# Altium schematic sheet Sheet1.SchDoc
size A3
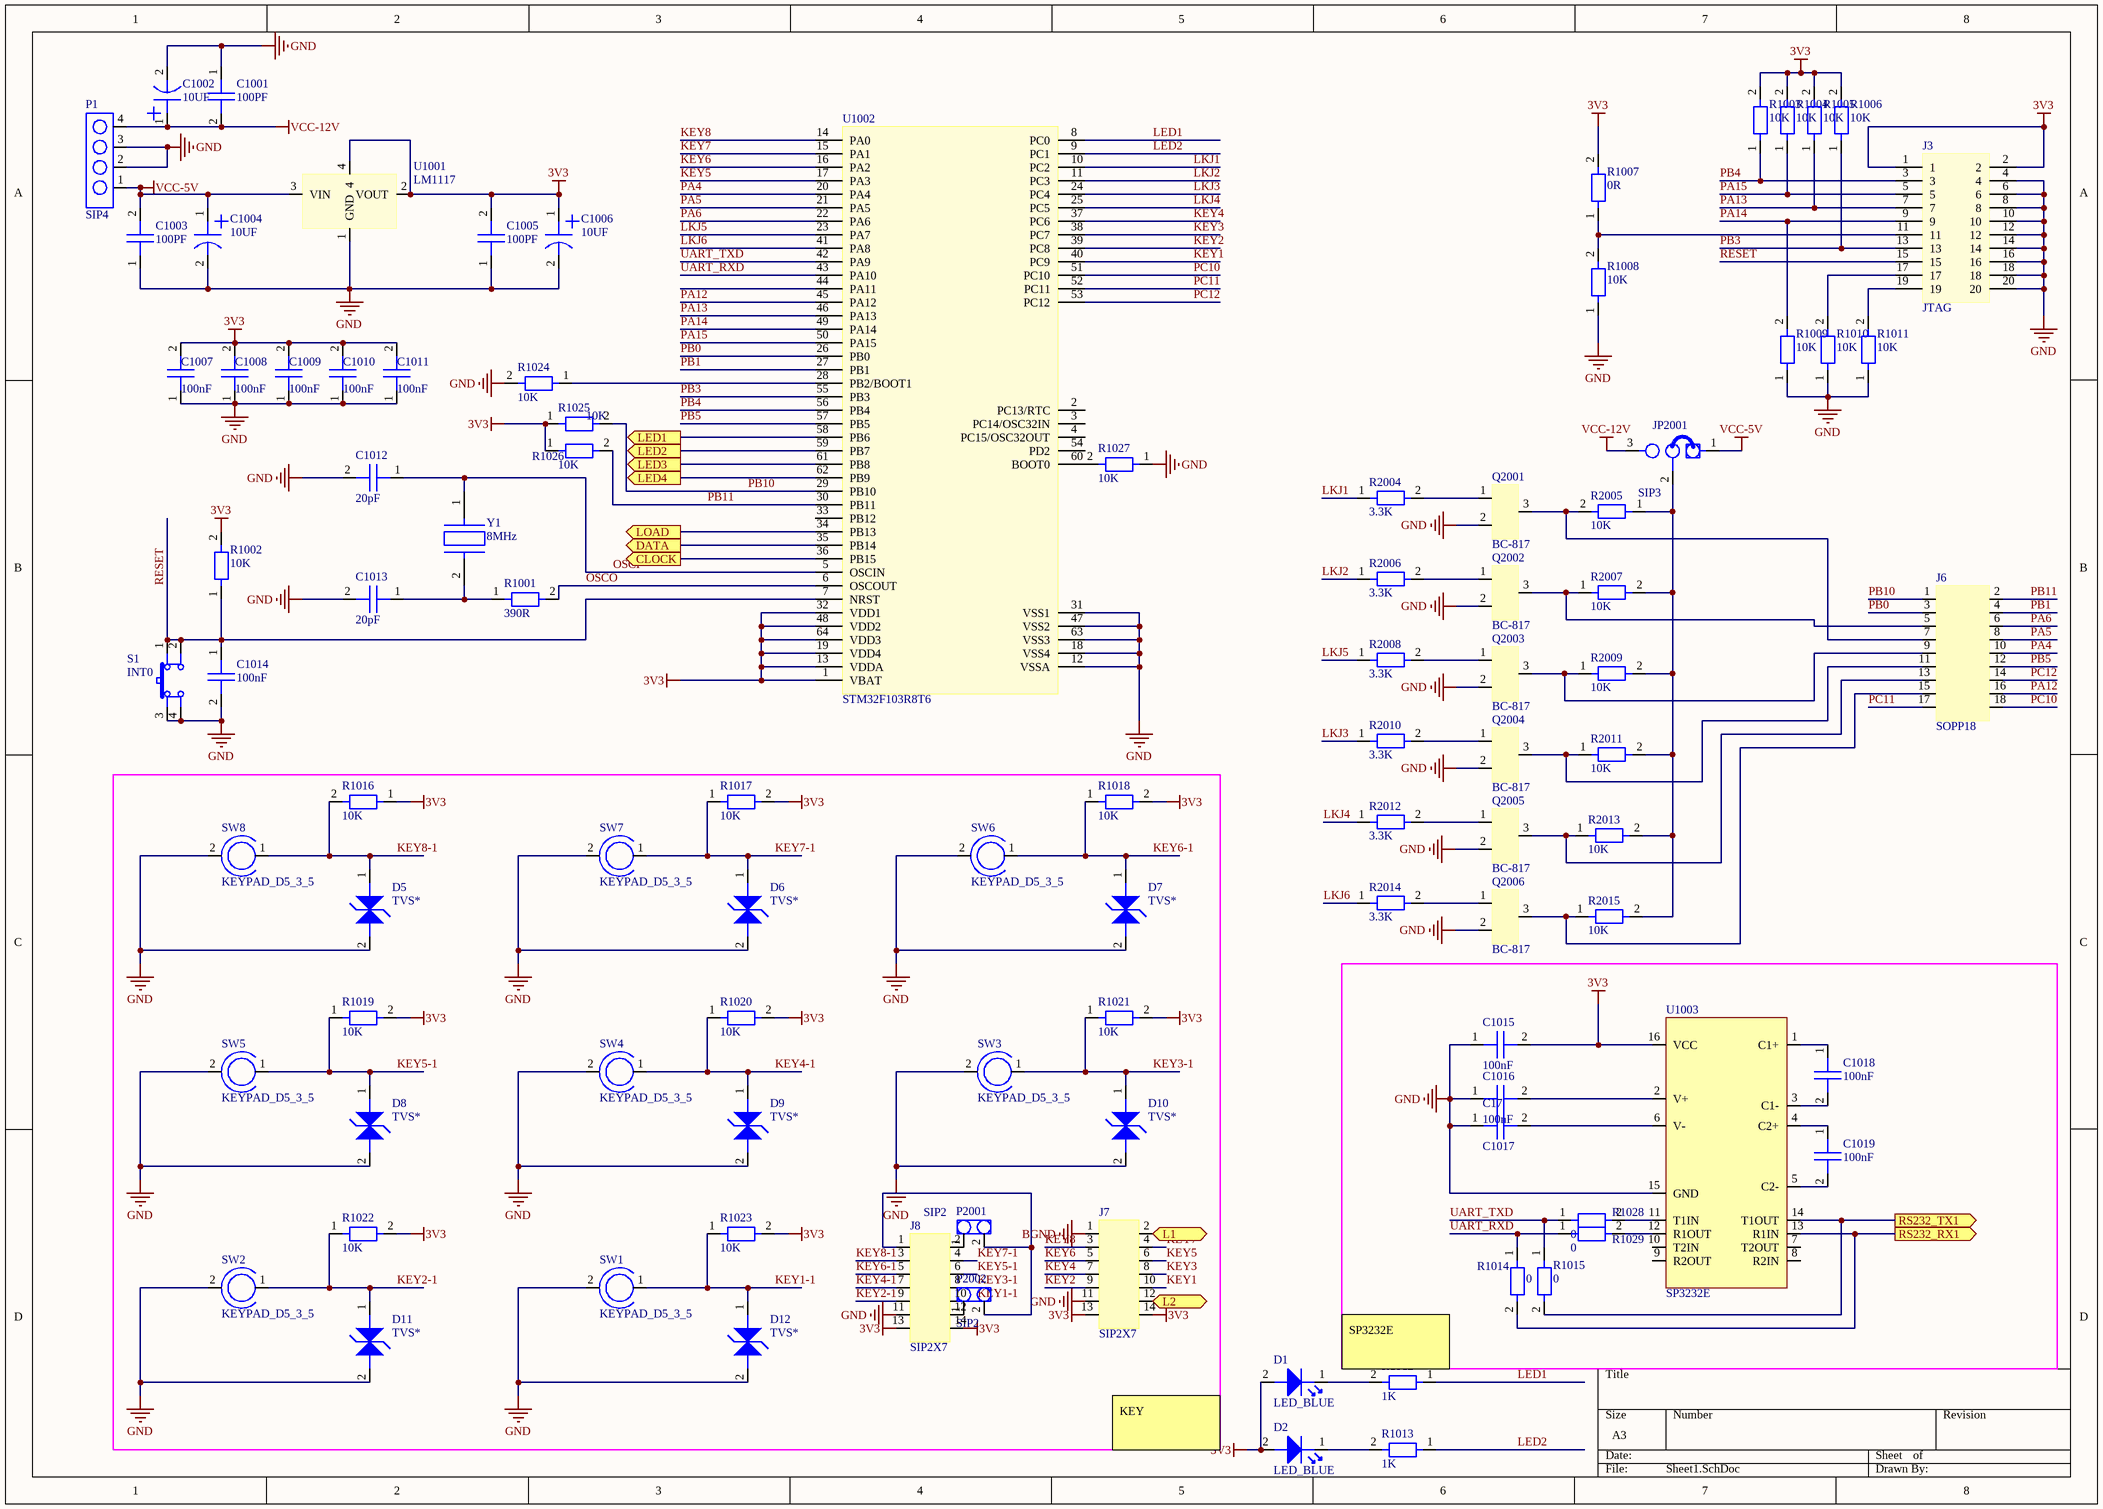
[diagram p0: Sheet1.SchDoc]

## Parts
C17  C1017  [0603]
C1001  100PF  [0603]
C1002  10UF  [7343]
C1003  100PF  [0603]
C1004  10UF  [7343]
C1005  100PF  [0603]
C1006  10UF  [7343]
C1007  100nF  [0603]
C1008  100nF  [0603]
C1009  100nF  [0603]
C1010  100nF  [0603]
C1011  100nF  [0603]
C1012  20pF  [0603]
C1013  20pF  [0603]
C1014  100nF  [0603]
C1015  100nF  [0603]
C1016  100nF  [0603]
C1018  100nF  [0603]
C1019  100nF  [0603]
D1  LED_BLUE  [0603]
D2  LED_BLUE  [0603]
D5  TVS*  [0603]
D6  TVS*  [0603]
D7  TVS*  [0603]
D8  TVS*  [0603]
D9  TVS*  [0603]
D10  TVS*  [0603]
D11  TVS*  [0603]
D12  TVS*  [0603]
J3  JTAG  [SOP20]
J6  SOPP18  [SOP18]
J7  SIP2X7  [DB2X7-2.54]
J8  SIP2X7  [DB2X7-2.54]
JP2001  SIP3  [SIP3]
P1  SIP4  [SIP4]
P2001  SIP2  [1.25T-2P]
P2002  SIP2  [1.25T-2P]
Q2001  BC-817  [S9013]
Q2002  BC-817  [S9013]
Q2003  BC-817  [S9013]
Q2004  BC-817  [S9013]
Q2005  BC-817  [S9013]
Q2006  BC-817  [S9013]
R1001  390R  [0603]
R1002  10K  [0603]
R1003  10K  [0603]
R1004  10K  [0603]
R1005  10K  [0603]
R1006  10K  [0603]
R1007  0R  [0603]
R1008  10K  [0603]
R1009  10K  [0603]
R1010  10K  [0603]
R1011  10K  [0603]
R1012  1K  [0603]
R1013  1K  [0603]
R1014  0  [0603]
R1015  0  [0603]
R1016  10K  [0603]
R1017  10K  [0603]
R1018  10K  [0603]
R1019  10K  [0603]
R1020  10K  [0603]
R1021  10K  [0603]
R1022  10K  [0603]
R1023  10K  [0603]
R1024  10K  [0603]
R1025  10K  [0603]
R1026  10K  [0603]
R1027  10K  [0603]
R1028  0  [0603]
R1029  0  [0603]
R2004  3.3K  [0603]
R2005  10K  [0603]
R2006  3.3K  [0603]
R2007  10K  [0603]
R2008  3.3K  [0603]
R2009  10K  [0603]
R2010  3.3K  [0603]
R2011  10K  [0603]
R2012  3.3K  [0603]
R2013  10K  [0603]
R2014  3.3K  [0603]
R2015  10K  [0603]
S1  INT0  [SW]
SW1  KEYPAD_D5_3_5  [AJB-9MM]
SW2  KEYPAD_D5_3_5  [AJB-9MM]
SW3  KEYPAD_D5_3_5  [AJB-9MM]
SW4  KEYPAD_D5_3_5  [AJB-9MM]
SW5  KEYPAD_D5_3_5  [AJB-9MM]
SW6  KEYPAD_D5_3_5  [AJB-9MM]
SW7  KEYPAD_D5_3_5  [AJB-9MM]
SW8  KEYPAD_D5_3_5  [AJB-9MM]
U1001  LM1117  [LM1117]
U1002  STM32F103R8T6  [STM32F103R8T6]
U1003  SP3232E  [SP3232E-SOIC]
Y1  8MHz  [HC-49S]

## Ports
CLOCK (out), DATA (out), L1 (out), L2 (out), LED1 (out), LED2 (out), LED3 (out), LED4 (out), LOAD (out), RS232_RX1 (out), RS232_TX1 (out)

## Nets
3V3: C1005.2 C1006.1 C1007.2 C1008.2 C1009.2 C1010.2 C1011.2 C1015.2 D1.2 D2.2 J3.1 J3.2 J7.13 J7.14 J8.13 J8.14 R1002.2 R1003.2 R1004.2 R1005.2 R1006.2 R1007.2 R1016.1 R1017.2 R1018.2 R1019.2 R1020.2 R1021.2 R1022.2 R1023.2 R1025.1 R1026.1 U1001.2(VOUT) U1001.4 U1002.1(VBAT) U1002.13(VDDA) U1002.19(VDD4) U1002.32(VDD1) U1002.48(VDD2) U1002.64(VDD3) U1003.16(VCC)
BGND: J7.1
GND: C17.1 C1001.1 C1002.2 C1003.1 C1004.2 C1005.1 C1006.2 C1007.1 C1008.1 C1009.1 C1010.1 C1011.1 C1012.2 C1013.2 C1014.2 C1015.1 C1016.1 D5.2 D6.2 D7.2 D8.2 D9.2 D10.2 D11.2 D12.2 J3.4 J3.6 J3.8 J3.10 J3.12 J3.14 J3.16 J3.18 J3.20 J7.11 J8.11 P1.2 P1.3 Q2001.2 Q2002.2 Q2003.2 Q2004.2 Q2005.2 Q2006.2 R1008.1 R1009.1 R1010.1 R1011.1 R1024.2 R1027.1 S1.3 S1.4 SW1.2 SW2.2 SW3.2 SW4.2 SW5.2 SW6.2 SW7.2 SW8.2 U1001.1(GND) U1002.12(VSSA) U1002.18(VSS4) U1002.31(VSS1) U1002.47(VSS2) U1002.63(VSS3) U1003.15(GND)
VCC-5V: C1003.2 C1004.1 JP2001.1 P1.1 U1001.3(VIN)
VCC-12V: C1001.2 C1002.1 JP2001.3 P1.4
CLOCK: U1002.36(PB15) ; port CLOCK
DATA: U1002.35(PB14) ; port DATA
KEY1: J7.10 U1002.40(PC9)
KEY1-1: D12.1 J8.10 R1023.1 SW1.1
KEY2: J7.9 U1002.39(PC8)
KEY2-1: D11.1 J8.9 R1022.1 SW2.1
KEY3: J7.8 U1002.38(PC7)
KEY3-1: D10.1 J8.8 R1021.1 SW3.1
KEY4: J7.7 U1002.37(PC6)
KEY4-1: D9.1 J8.7 R1020.1 SW4.1
KEY5: J7.6 U1002.17(PA3)
KEY5-1: D8.1 J8.6 R1019.1 SW5.1
KEY6: J7.5 U1002.16(PA2)
KEY6-1: D7.1 J8.5 R1018.1 SW6.1
KEY7: J7.4 U1002.15(PA1)
KEY7-1: D6.1 J8.4 R1017.1 SW7.1
KEY8: J7.3 U1002.14(PA0)
KEY8-1: D5.1 J8.3 R1016.2 SW8.1
L1: J7.2 ; port L1
L2: J7.12 ; port L2
LED1: R1012.1 U1002.8(PC0)
LED1: U1002.58(PB6) ; port LED1  [a separate net that carries the same name]
LED2: R1013.1 U1002.9(PC1)
LED2: U1002.59(PB7) ; port LED2  [a separate net that carries the same name]
LED3: U1002.61(PB8) ; port LED3
LED4: U1002.62(PB9) ; port LED4
LKJ1: R2004.1 U1002.10(PC2)
LKJ2: R2006.1 U1002.11(PC3)
LKJ3: R2010.1 U1002.24(PC4)
LKJ4: R2012.1 U1002.25(PC5)
LKJ5: R2008.1 U1002.23(PA7)
LKJ6: R2014.1 U1002.41(PA8)
LOAD: U1002.34(PB13) ; port LOAD
OSCI: C1012.1 U1002.5(OSCIN) Y1.1
OSCO: R1001.2 U1002.6(OSCOUT)
PA4: J6.10 U1002.20(PA4)
PA5: J6.8 U1002.21(PA5)
PA6: J6.6 U1002.22(PA6)
PA12: J6.16 U1002.45(PA12)
PA13: J3.7 R1005.1 U1002.46(PA13)
PA14: J3.9 R1009.2 U1002.49(PA14)
PA15: J3.5 R1004.1 U1002.50(PA15)
PB0: J6.3 U1002.26(PB0)
PB1: J6.4 U1002.27(PB1)
PB3: J3.13 R1006.1 U1002.55(PB3)
PB4: J3.3 R1003.1 U1002.56(PB4)
PB5: J6.12 U1002.57(PB5)
PB10: J6.1 R1025.2 U1002.29(PB10)
PB11: J6.2 R1026.2 U1002.30(PB11)
PC10: J6.18 U1002.51(PC10)
PC11: J6.17 U1002.52(PC11)
PC12: J6.14 U1002.53(PC12)
RESET: C1014.1 J3.15 R1002.1 S1.1 S1.2 U1002.7(NRST)
RS232_RX1: R1014.2 U1003.13(R1IN) ; port RS232_RX1
RS232_TX1: R1015.2 U1003.14(T1OUT) ; port RS232_TX1
UART_RXD: R1014.1 R1029.1 U1002.43(PA10)
UART_TXD: R1015.1 R1028.1 U1002.42(PA9)
NetC17_2: C17.2 U1003.6(V-)
NetC1013_1: C1013.1 R1001.1 Y1.2
NetC1016_2: C1016.2 U1003.2(V+)
NetC1018_1: C1018.1 U1003.1(C1+)
NetC1018_2: C1018.2 U1003.3(C1-)
NetC1019_1: C1019.1 U1003.4(C2+)
NetC1019_2: C1019.2 U1003.5(C2-)
NetD1_1: D1.1 R1012.2
NetD2_1: D2.1 R1013.2
NetJ3_11: J3.11 R1007.1 R1008.2
NetJ3_17: J3.17 R1010.2
NetJ3_19: J3.19 R1011.2
NetJ6_5: J6.5 Q2002.3 R2007.1
NetJ6_7: J6.7 Q2001.3 R2005.2
NetJ6_9: J6.9 Q2003.3 R2009.1
NetJ6_11: J6.11 Q2004.3 R2011.1
NetJ6_13: J6.13 Q2005.3 R2013.1
NetJ6_15: J6.15 Q2006.3 R2015.1
NetJ8_1: J8.1 P2001.2 P2002.2
NetJ8_2: J8.2 P2001.1
NetJ8_12: J8.12 P2002.1
NetJP2001_2: JP2001.2 R2005.1 R2007.2 R2009.2 R2011.2 R2013.2 R2015.2
NetQ2001_1: Q2001.1 R2004.2
NetQ2002_1: Q2002.1 R2006.2
NetQ2003_1: Q2003.1 R2008.2
NetQ2004_1: Q2004.1 R2010.2
NetQ2005_1: Q2005.1 R2012.2
NetQ2006_1: Q2006.1 R2014.2
NetR1024_1: R1024.1 U1002.28(PB2/BOOT1)
NetR1027_2: R1027.2 U1002.60(BOOT0)
NetR1028_2: R1028.2 U1003.11(T1IN)
NetR1029_2: R1029.2 U1003.12(R1OUT)

Not connected (* = marked no-connect by the designer): U1002 2(PC13/RTC) 3(PC14/OSC32IN) 4(PC15/OSC32OUT) 33(PB12) 44(PA11) 54(PD2); U1003 7(T2OUT) 8(R2IN) 9(R2OUT) 10(T2IN)

## Notes on the sheet
- (near R1012) SP3232E
- KEY

## Library data of the parts
C17 C1001 C1003 C1005 C1007-C1016 C1018 C1019 = C
C1002 C1004 C1006 = JC
D5-D12 = TVS
R1001-R1029 R2004-R2015 = R
Y1 = CRYSTAL